# EAGLE schematic ArduSatArduinoAdapterModule (EAGLE 6.3)
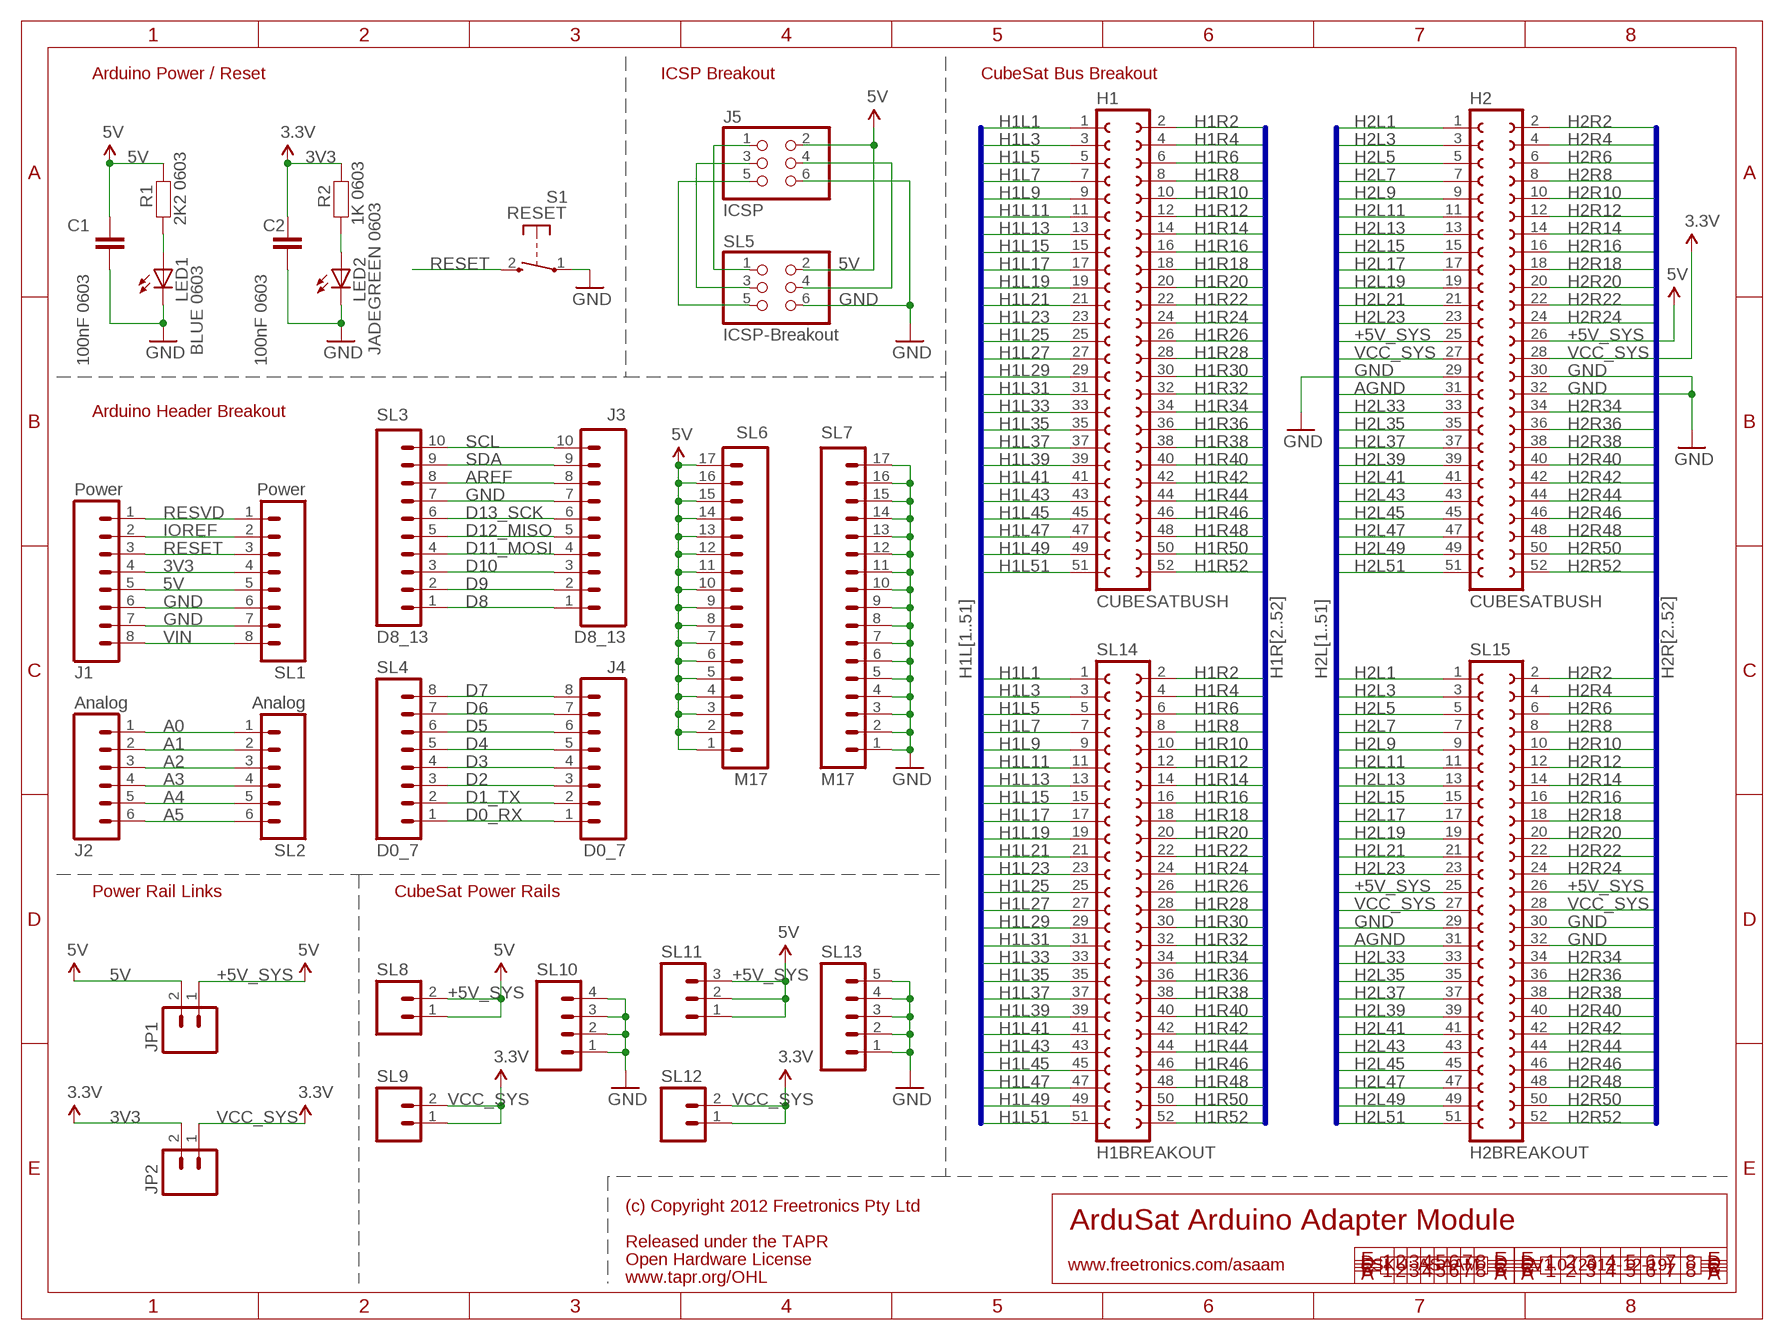
[diagram p0: schematic, sheet 1]

## Parts
C1  100nF 0603  CAP0603  [0603]
C2  100nF 0603  CAP0603  [0603]
H1  CUBESATBUSH  [CUBESATBUS]
H2  CUBESATBUSH  [CUBESATBUS]
J1  Power  M08STD  [1X08]
J2  Analog  M06SIP  [1X06]
J3  D8_13  M100.1  [1X10]
J4  D0_7  M08STD  [1X08]
J5  ICSP  ICSPPTH  [2X03PTH]
JP1  M02PTH  [1X02]
JP2  M02PTH  [1X02]
LED1  BLUE 0603  LED0603  [LED-0603]
LED2  JADEGREEN 0603  LED0603  [LED-0603]
R1  2K2 0603  RESISTOR0603  [0603]
R2  1K 0603  RESISTOR0603  [0603]
S1  RESET  TAC_SWITCH_2PIN  [TACTILE_SWITCH_SMD_2PIN_TINY]
SL1  Power  M08STD  [1X08]
SL2  Analog  M06SIP  [1X06]
SL3  D8_13  M100.1  [1X10]
SL4  D0_7  M08STD  [1X08]
SL5  ICSP-Breakout  ICSPPTH  [2X03PTH]
SL6  M17  [1X17]
SL7  M17  [1X17]
SL8  M02PTH  [1X02]
SL9  M02PTH  [1X02]
SL10  M04PTH  [1X04]
SL11  M03PTH  [1X03]
SL12  M02PTH  [1X02]
SL13  M05PTH  [1X05]
SL14  H1BREAKOUT  CUBESATBUSH  [CUBESATBUS]
SL15  H2BREAKOUT  CUBESATBUSH  [CUBESATBUS]

## Nets
3V3: C2.1 J1.4 JP2.2 R2.1 SL1.4 ; supply symbol labelled 3.3V
5V: C1.1 J1.5 J5.2 JP1.2 R1.1 SL1.5 SL5.2 SL6.1 SL6.2 SL6.3 SL6.4 SL6.5 SL6.6 SL6.7 SL6.8 SL6.9 SL6.10 SL6.11 SL6.12 SL6.13 SL6.14 SL6.15 SL6.16 SL6.17
+5V_SYS: H2.25 H2.26 JP1.1 SL8.1 SL8.2 SL11.1 SL11.2 SL11.3 SL15.25 SL15.26 ; supply symbol labelled 5V
A0: J2.1 SL2.1
A1: J2.2 SL2.2
A2: J2.3 SL2.3
A3: J2.4 SL2.4
A4: J2.5 SL2.5
A5: J2.6 SL2.6
AGND: H2.31 SL15.31
AREF: J3.8 SL3.8
D0_RX: J4.1 SL4.1
D1_TX: J4.2 SL4.2
D2: J4.3 SL4.3
D3: J4.4 SL4.4
D4: J4.5 SL4.5
D5: J4.6 SL4.6
D6: J4.7 SL4.7
D7: J4.8 SL4.8
D8: J3.1 SL3.1
D9: J3.2 SL3.2
D10: J3.3 SL3.3
D11_MOSI: J3.4 SL3.4
D12_MISO: J3.5 SL3.5
D13_SCK: J3.6 SL3.6
GND: C1.2 C2.2 H2.29 H2.30 H2.32 J1.6 J1.7 J3.7 J5.6 LED1.C LED2.C S1.1(P) SL1.6 SL1.7 SL3.7 SL5.6 SL7.1 SL7.2 SL7.3 SL7.4 SL7.5 SL7.6 SL7.7 SL7.8 SL7.9 SL7.10 SL7.11 SL7.12 SL7.13 SL7.14 SL7.15 SL7.16 SL7.17 SL10.1 SL10.2 SL10.3 SL10.4 SL13.1 SL13.2 SL13.3 SL13.4 SL13.5 SL15.29 SL15.30 SL15.32
H1L1: H1.1 SL14.1
H1L3: H1.3 SL14.3
H1L5: H1.5 SL14.5
H1L7: H1.7 SL14.7
H1L9: H1.9 SL14.9
H1L11: H1.11 SL14.11
H1L13: H1.13 SL14.13
H1L15: H1.15 SL14.15
H1L17: H1.17 SL14.17
H1L19: H1.19 SL14.19
H1L21: H1.21 SL14.21
H1L23: H1.23 SL14.23
H1L25: H1.25 SL14.25
H1L27: H1.27 SL14.27
H1L29: H1.29 SL14.29
H1L31: H1.31 SL14.31
H1L33: H1.33 SL14.33
H1L35: H1.35 SL14.35
H1L37: H1.37 SL14.37
H1L39: H1.39 SL14.39
H1L41: H1.41 SL14.41
H1L43: H1.43 SL14.43
H1L45: H1.45 SL14.45
H1L47: H1.47 SL14.47
H1L49: H1.49 SL14.49
H1L51: H1.51 SL14.51
H1R2: H1.2 SL14.2
H1R4: H1.4 SL14.4
H1R6: H1.6 SL14.6
H1R8: H1.8 SL14.8
H1R10: H1.10 SL14.10
H1R12: H1.12 SL14.12
H1R14: H1.14 SL14.14
H1R16: H1.16 SL14.16
H1R18: H1.18 SL14.18
H1R20: H1.20 SL14.20
H1R22: H1.22 SL14.22
H1R24: H1.24 SL14.24
H1R26: H1.26 SL14.26
H1R28: H1.28 SL14.28
H1R30: H1.30 SL14.30
H1R32: H1.32 SL14.32
H1R34: H1.34 SL14.34
H1R36: H1.36 SL14.36
H1R38: H1.38 SL14.38
H1R40: H1.40 SL14.40
H1R42: H1.42 SL14.42
H1R44: H1.44 SL14.44
H1R46: H1.46 SL14.46
H1R48: H1.48 SL14.48
H1R50: H1.50 SL14.50
H1R52: H1.52 SL14.52
H2L1: H2.1 SL15.1
H2L3: H2.3 SL15.3
H2L5: H2.5 SL15.5
H2L7: H2.7 SL15.7
H2L9: H2.9 SL15.9
H2L11: H2.11 SL15.11
H2L13: H2.13 SL15.13
H2L15: H2.15 SL15.15
H2L17: H2.17 SL15.17
H2L19: H2.19 SL15.19
H2L21: H2.21 SL15.21
H2L23: H2.23 SL15.23
H2L33: H2.33 SL15.33
H2L35: H2.35 SL15.35
H2L37: H2.37 SL15.37
H2L39: H2.39 SL15.39
H2L41: H2.41 SL15.41
H2L43: H2.43 SL15.43
H2L45: H2.45 SL15.45
H2L47: H2.47 SL15.47
H2L49: H2.49 SL15.49
H2L51: H2.51 SL15.51
H2R2: H2.2 SL15.2
H2R4: H2.4 SL15.4
H2R6: H2.6 SL15.6
H2R8: H2.8 SL15.8
H2R10: H2.10 SL15.10
H2R12: H2.12 SL15.12
H2R14: H2.14 SL15.14
H2R16: H2.16 SL15.16
H2R18: H2.18 SL15.18
H2R20: H2.20 SL15.20
H2R22: H2.22 SL15.22
H2R24: H2.24 SL15.24
H2R34: H2.34 SL15.34
H2R36: H2.36 SL15.36
H2R38: H2.38 SL15.38
H2R40: H2.40 SL15.40
H2R42: H2.42 SL15.42
H2R44: H2.44 SL15.44
H2R46: H2.46 SL15.46
H2R48: H2.48 SL15.48
H2R50: H2.50 SL15.50
H2R52: H2.52 SL15.52
IOREF: J1.2 SL1.2
N$1: LED2.A R2.2
N$6: LED1.A R1.2
N$35: J5.4 SL5.4
N$51: J5.1 SL5.1
N$52: J5.3 SL5.3
N$53: J5.5 SL5.5
RESET: J1.3 S1.2(S) SL1.3
RESVD: J1.1 SL1.1
SCL: J3.10 SL3.10
SDA: J3.9 SL3.9
VCC_SYS: H2.27 H2.28 JP2.1 SL9.1 SL9.2 SL12.1 SL12.2 SL15.27 SL15.28 ; supply symbol labelled 3.3V
VIN: J1.8 SL1.8

## Buses
H1L[1..51]
H1R[2..52]
H2L[1..51]
H2R[2..52]

## Notes on the sheet
- Arduino Power / Reset | ICSP Breakout | CubeSat Bus Breakout
- Arduino Header Breakout
- Power Rail Links | CubeSat Power Rails
- (c) Copyright 2012 Freetronics Pty Ltd
- ArduSat Arduino Adapter Module
- Released under the TAPR
- Open Hardware License
- www.freetronics.com/asaam | SKU: ASAAM | V1.0 (2012-12-19)
- www.tapr.org/OHL

## Library data of the parts
C1 C2 = freetronics-master-v1.1:CAP: Capacitor Standard 0603 ceramic capacitor, and 0.1" leaded capacitor.
H1 H2 SL14 SL15 = freetronics-jon:CUBESATBUS
J1 J4 SL1 SL4 = freetronics-master-v1.1:M08: Header 8 Standard 8-pin 0.1" header. Use with straight break away headers (SKU : PRT-00116), right angle break away headers (PRT-00553), swiss pins (PRT-00743), machine pins (PRT-00117), and female headers (PRT-00115).
J2 SL2 = freetronics-master-v1.1:M06: Header 6 Standard 6-pin 0.1" header. Use with straight break away headers (SKU : PRT-00116), right angle break away headers (PRT-00553), swiss pins (PRT-00743), machine pins (PRT-00117), and female headers (PRT-00115). Molex polarized connector foot print use with SKU : PRT-08094 with associated crimp pins and housings. NOTES ON THE VARIANTS LOCK and LOCK_LONGPADS... This footprint was designed to help hold the alignment of a through-hole component (i.e. 6-pin header) while soldering it into place. You may notice that each hole has been shifted either up or down by 0.005 of an inch from it's more standard position (which is a perfectly straight line). This slight alteration caused the pins (the squares in the middle) to touch the edges of the holes. Because they are alternating, it causes a "brace" to hold the component in place. 0.005 has proven to be the perfect amount of "off-center" position when using our standard breakaway headers. Although looks a little odd when you look at the bare footprint, once you have a header in there, the alteration is very hard to notice. Also, if you push a header all the way into place, it is covered up entirely on the bottom side. This idea of altering the position of holes to aid alignment will be further integrated into the Sparkfun Library for other footprints. It can help hold any component with 3 or more connection pins.
J3 SL3 = freetronics-original:M10: Header 10 Standard 10-pin 0.1" header. Use with straight break away headers (SKU : PRT-00116), right angle break away headers (PRT-00553), swiss pins (PRT-00743), machine pins (PRT-00117), and female headers (PRT-00115).
J5 SL5 = freetronics-jon:ICSP
JP1 JP2 SL8 SL9 SL12 = freetronics-master-v1.1:M02: Header 2 Standard 2-pin 0.1" header. Use with straight break away headers (SKU : PRT-00116), right angle break away headers (PRT-00553), swiss pins (PRT-00743), machine pins (PRT-00117), and female headers (PRT-00115). Molex polarized connector foot print use with SKU : PRT-08233 with associated crimp pins and housings.
LED1 LED2 = freetronics-jon:LED: LEDs Standard schematic elements and footprints for 5mm, 3mm, 1206, and 0603 sized LEDs. 5mm - Spark Fun Electronics SKU : COM-00529 (and others)
R1 R2 = freetronics-master-v1.1:RESISTOR: Resistor Basic schematic elements and footprints for 0603, 1206, and PTH 1/10th watt (small) resistors.
S1 = freetronics-master-v1:TAC_SWITCH_2PIN: Momentary Tactile Switch - 2 pin
SL6 SL7 = freetronics-master-v1.1:M17
SL10 = freetronics-master-v1.1:M04: Header 4 Standard 4-pin 0.1" header. Use with straight break away headers (SKU : PRT-00116), right angle break away headers (PRT-00553), swiss pins (PRT-00743), machine pins (PRT-00117), and female headers (PRT-00115). Molex polarized connector foot print use with SKU : PRT-08231 with associated crimp pins and housings.
SL11 = freetronics-master-v1.1:M03: Header 3 Standard 3-pin 0.1" header. Use with straight break away headers (SKU : PRT-00116), right angle break away headers (PRT-00553), swiss pins (PRT-00743), machine pins (PRT-00117), and female headers (PRT-00115). Molex polarized connector foot print use with SKU : PRT-08232 with associated crimp pins and housings.
SL13 = freetronics-master-v1.1:M05: Header 5 Standard 5-pin 0.1" header. Use with straight break away headers (SKU : PRT-00116), right angle break away headers (PRT-00553), swiss pins (PRT-00743), machine pins (PRT-00117), and female headers (PRT-00115). Molex polarized connector foot print use with SKU : PRT-08230 with associated crimp pins and housings.